# Altium schematic sheet MODEM_PT2.SchDoc: VBATT, LED, LVL SHIFT
size 420 x 297 mm; SheetNumber: 4
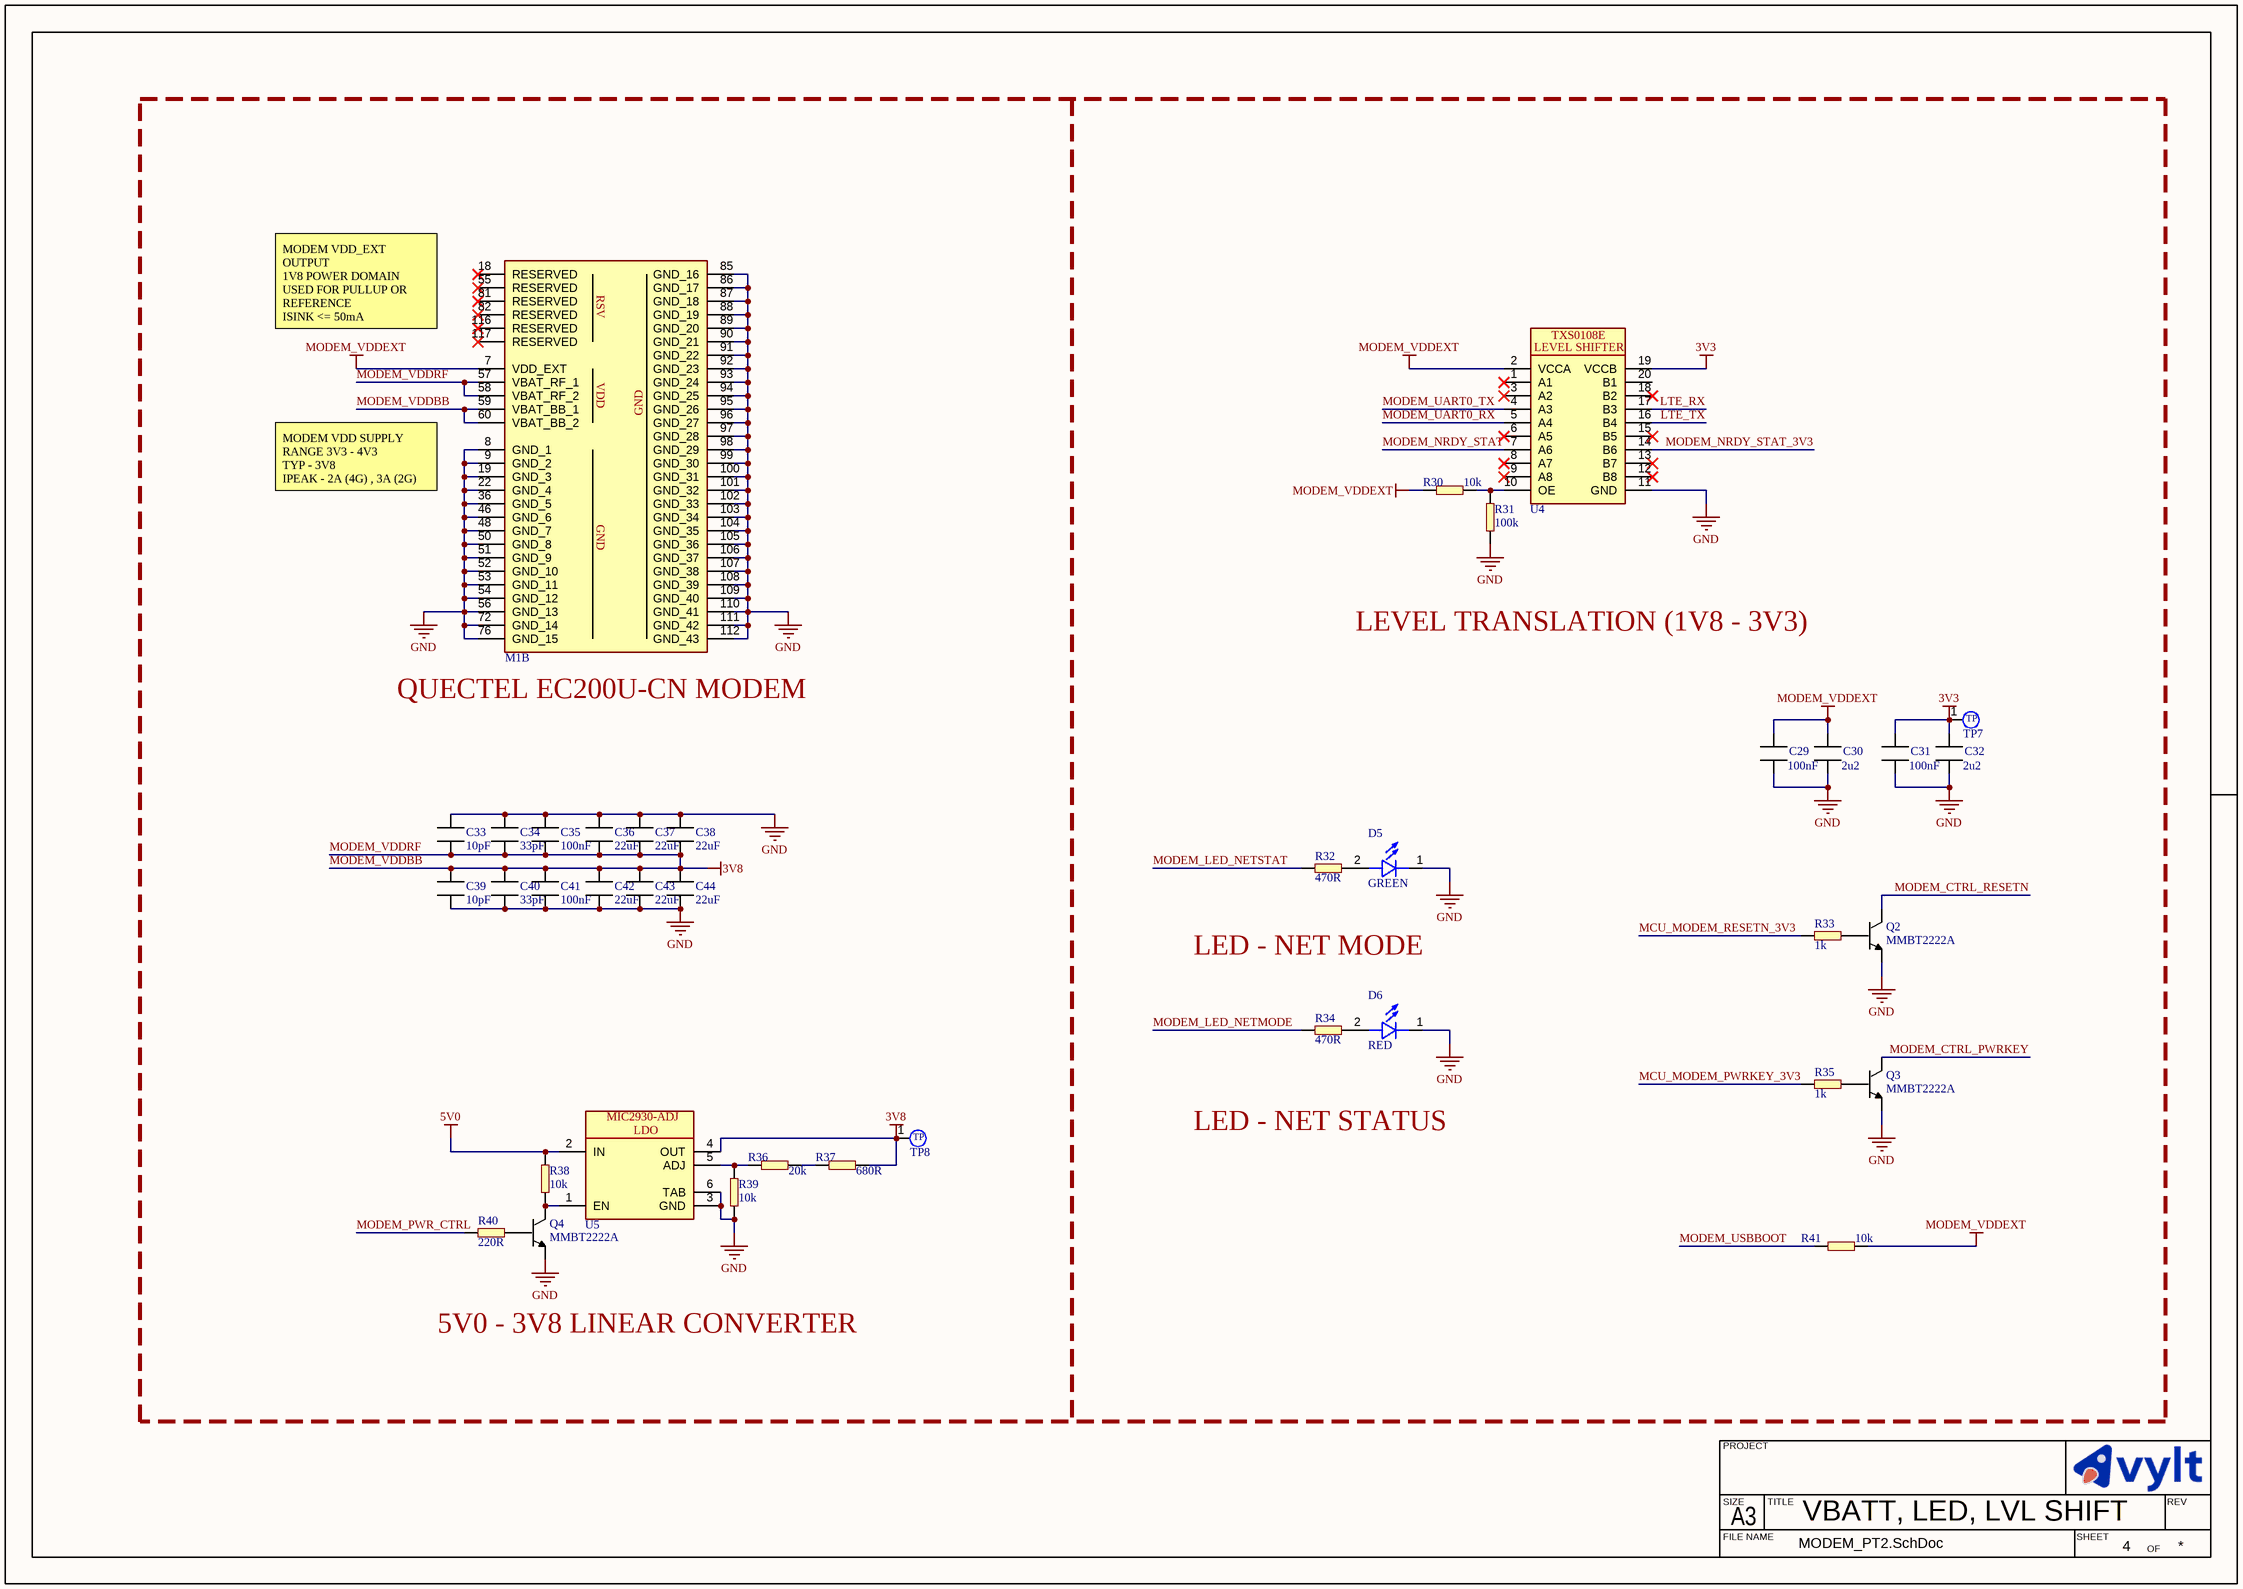
[diagram p0: MODEM_PT2.SchDoc]

## Parts
C29  value 100nF  [CAPC2012X13L]  (hidden comment: MLCC_0805)
C30  value 2u2  [CAPC2012X13L]  (hidden comment: MLCC_0805)
C31  value 100nF  [CAPC2012X13L]  (hidden comment: MLCC_0805)
C32  value 2u2  [CAPC2012X13L]  (hidden comment: MLCC_0805)
C33  value 10pF  [CAPC2012X13L]  (hidden comment: MLCC_0805)
C34  value 33pF  [CAPC2012X13L]  (hidden comment: MLCC_0805)
C35  value 100nF  [CAPC2012X13L]  (hidden comment: MLCC_0805)
C36  value 22uF  [CAPC2012X13L]  (hidden comment: MLCC_0805)
C37  value 22uF  [CAPC2012X13L]  (hidden comment: MLCC_0805)
C38  value 22uF  [CAPC2012X13L]  (hidden comment: MLCC_0805)
C39  value 10pF  [CAPC2012X13L]  (hidden comment: MLCC_0805)
C40  value 33pF  [CAPC2012X13L]  (hidden comment: MLCC_0805)
C41  value 100nF  [CAPC2012X13L]  (hidden comment: MLCC_0805)
C42  value 22uF  [CAPC2012X13L]  (hidden comment: MLCC_0805)
C43  value 22uF  [CAPC2012X13L]  (hidden comment: MLCC_0805)
C44  value 22uF  [CAPC2012X13L]  (hidden comment: MLCC_0805)
D5  value GREEN  [LED_1206]  (hidden comment: LED_1206)
D6  value RED  [LED_1206]  (hidden comment: LED_1206)
M1  EC200U  [EC200U]  (value not drawn)  (part B of 2)
Q2  value MMBT2222A  [MMBT2222]  (hidden comment: ERP_105-1)
Q3  value MMBT2222A  [MMBT2222]  (hidden comment: ERP_105-1)
Q4  value MMBT2222A  [MMBT2222]  (hidden comment: ERP_105-1)
R30  value 10k  [RES_0603]  (hidden comment: ERP_101-1)
R31  value 100k  [RES_0603]  (hidden comment: ERP_101-1)
R32  value 470R  [RES_0603]  (hidden comment: ERP_101-1)
R33  value 1k  [RES_0603]  (hidden comment: ERP_101-1)
R34  value 470R  [RES_0603]  (hidden comment: ERP_101-1)
R35  value 1k  [RES_0603]  (hidden comment: ERP_101-1)
R36  value 20k  [RES_0603]  (hidden comment: ERP_101-1)
R37  value 680R  [RES_0603]  (hidden comment: ERP_101-1)
R38  value 10k  [RES_0603]  (hidden comment: ERP_101-1)
R39  value 10k  [RES_0603]  (hidden comment: ERP_101-1)
R40  value 220R  [RES_0603]  (hidden comment: ERP_101-1)
R41  value 10k  [RES_0603]  (hidden comment: ERP_101-1)  (no BOM)
TP7  TP_1MM  [TP_1MM]  (value not drawn)  (no BOM)
TP8  TP_1MM  [TP_1MM]  (value not drawn)  (no BOM)
U4  TXS0108EPW  [TXS0108EPW]  (value not drawn)
U5  MIC2930  [DPAK170P1491X483-6N]  (value not drawn)

## Nets
3V3: C31.1 C32.1 TP7.1 U4.19(VCCB)
5V0: R38.1 U5.2(IN)
GND: C29.2 C30.2 C31.2 C32.2 C33.1 C34.1 C35.1 C36.1 C37.1 C38.1 C39.2 C40.2 C41.2 C42.2 C43.2 C44.2 D5.1 D6.1 M1.8(GND_1) M1.9(GND_2) M1.19(GND_3) M1.22(GND_4) M1.36(GND_5) M1.46(GND_6) M1.48(GND_7) M1.50(GND_8) M1.51(GND_9) M1.52(GND_10) M1.53(GND_11) M1.54(GND_12) M1.56(GND_13) M1.72(GND_14) M1.76(GND_15) M1.85(GND_16) M1.86(GND_17) M1.87(GND_18) M1.88(GND_19) M1.89(GND_20) M1.90(GND_21) M1.91(GND_22) M1.92(GND_23) M1.93(GND_24) M1.94(GND_25) M1.95(GND_26) M1.96(GND_27) M1.97(GND_28) M1.98(GND_29) M1.99(GND_30) M1.100(GND_31) M1.101(GND_32) M1.102(GND_33) M1.103(GND_34) M1.104(GND_35) M1.105(GND_36) M1.106(GND_37) M1.107(GND_38) M1.108(GND_39) M1.109(GND_40) M1.110(GND_41) M1.111(GND_42) M1.112(GND_43) Q2.2 Q3.2 Q4.2 R31.2 R39.2 U4.11(GND) U5.3(GND) U5.6(TAB)
MODEM_VDDBB: C33.2 C34.2 C35.2 C36.2 C37.2 C38.2 C39.1 C40.1 C41.1 C42.1 C43.1 C44.1 M1.57(VBAT_RF_1) M1.58(VBAT_RF_2) M1.59(VBAT_BB_1) M1.60(VBAT_BB_2) R37.1 TP8.1 U5.4(OUT)  [also labelled 3V8, MODEM_VDDRF]
MODEM_VDDEXT: C29.1 C30.1 M1.7(VDD_EXT) R30.2 R41.1 U4.2(VCCA)
LTE_RX: U4.17(B3)
LTE_TX: U4.16(B4)
MCU_MODEM_PWRKEY_3V3: R35.2
MCU_MODEM_RESETN_3V3: R33.2
MODEM_CTRL_PWRKEY: Q3.3
MODEM_CTRL_RESETN: Q2.3
MODEM_LED_NETMODE: R34.2
MODEM_LED_NETSTAT: R32.2
MODEM_NRDY_STAT: U4.7(A6)
MODEM_NRDY_STAT_3V3: U4.14(B6)
MODEM_PWR_CTRL: R40.1
MODEM_UART0_RX: U4.5(A4)
MODEM_UART0_TX: U4.4(A3)
MODEM_USBBOOT: R41.2
NetD5_2: D5.2 R32.1
NetD6_2: D6.2 R34.1
NetQ2_1: Q2.1 R33.1
NetQ3_1: Q3.1 R35.1
NetQ4_1: Q4.1 R40.2
NetQ4_3: Q4.3 R38.2 U5.1(EN)
NetR30_1: R30.1 R31.1 U4.10(OE)
NetR36_1: R36.1 R37.2
NetR36_2: R36.2 R39.1 U5.5(ADJ)

Not connected (* = marked no-connect by the designer): M1 18(RESERVED)* 55(RESERVED)* 81(RESERVED)* 82(RESERVED)* 116(RESERVED)* 117(RESERVED)*; U4 1(A1)* 3(A2)* 6(A5)* 8(A7)* 9(A8)* 12(B8)* 13(B7)* 15(B5)* 18(B2)* 20(B1)

## Notes on the sheet
- MODEM VDD_EXT OUTPUT
  1V8 POWER DOMAIN
  USED FOR PULLUP OR REFERENCE
  ISINK <= 50mA
- MODEM VDD SUPPLY
  RANGE 3V3 - 4V3
  TYP - 3V8
  IPEAK - 2A (4G) , 3A (2G)
- LEVEL TRANSLATION (1V8 - 3V3)
- (near M1) QUECTEL EC200U-CN MODEM
- LED - NET MODE
- LED - NET STATUS
- 5V0 - 3V8 LINEAR CONVERTER
- PROJECT
- SIZE
- FILE NAME
- A3
- TITLE
- SHEET
- OF
- REV
- (in symbol EC200U, part B) RSV; VDD; GND
- (in symbol MIC2930) MIC2930-ADJ; LDO
- (in symbol TP_1MM) TP
- (in symbol TXS0108EPW) TXS0108E; LEVEL SHIFTER

## Library data of the parts
C29-C44 = MLCC_0805: Chip Capacitor, 2-Leads, Body 2.00x1.25mm, IPC High Density; Package: 0805; Manufacturer 1: *; Manufacturer Part Number 1: *
D5 = LED_1206: LED CLEAR 1206 SMD; Manufacturer Part Number 1: 6395; Manufacturer 1: Sunrom
D6 = LED_1206: LED CLEAR 1206 SMD; Manufacturer Part Number 1: 6394; Manufacturer 1: Sunrom
M1 = EC200U: LTE CAT1 MODEM 144 SMD; Manufacturer 1: Quectel; Manufacturer Part Number 1: 027-EC200UCNAA-N05-SGNSA; Value: *
Q2-Q4 = MMBT2222: MMBT2222A; ERP: *; Suuplier Part Number 1: *; Supplier 1: *; Manufacturer Part Number 1: *; Manufacturer 1: *; Package: SOT23
R30-R41 = RES_0603: Package: 0603; Manufacturer 1: *; Manufacturer Part Number 1: *
  R32-R40: ERP: *
U4 = TXS0108EPW: Voltage Level Translator Bidirectional 1 Circuit 8 Channel 60Mbps 20-TSSOP; Manufacturer Part Number 1: TXS0108EPWR; Manufacturer 1: Texas Instruments; Package: 20-TSSOP; Value: *
U5 = MIC2930: Linear Voltage Regulator IC Positive Adjustable 1 Output 3A TO-263-5; Manufacturer Part Number 1: *; Manufacturer 1: *; Value: *